# Altium schematic sheet [1]-SOM-G3399.SchDoc: [1]-SOM-G3399
size A3; DocumentNumber: NA; Revision: 2019.12.17; SheetNumber: 1; SheetTotal: 3
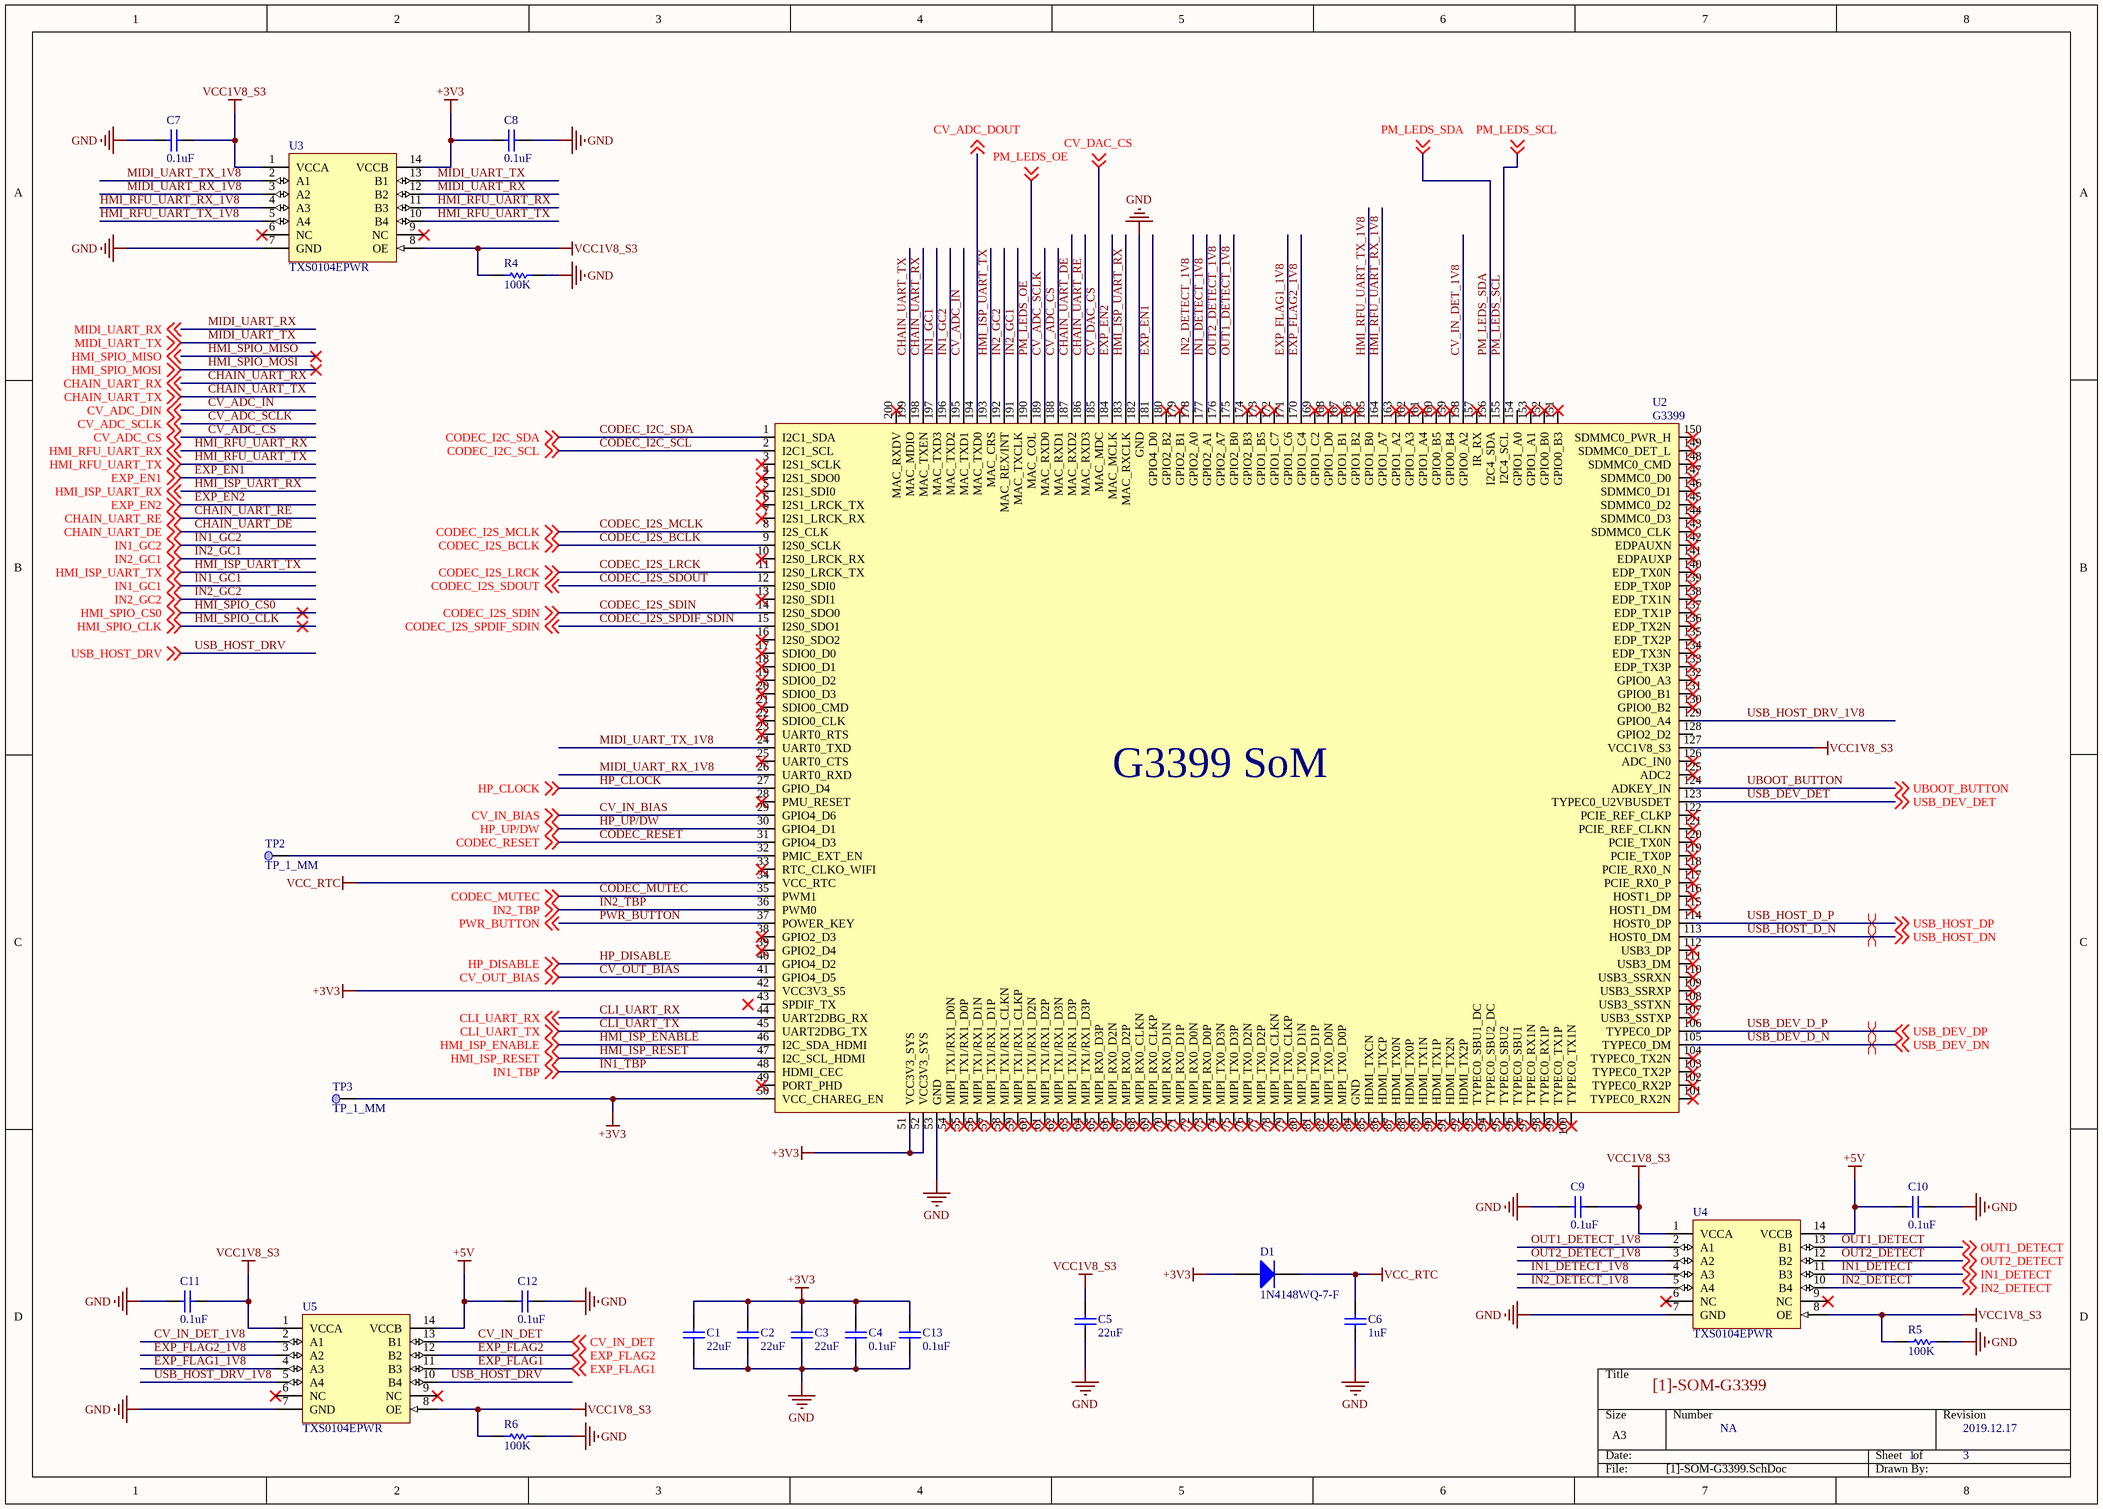
[diagram p0: [1]-SOM-G3399.SchDoc]

## Parts
C1  22uF  [CAPC1608N]
C2  22uF  [CAPC1608N]
C3  22uF  [CAPC1608N]
C4  0.1uF  [CAPC1005N]
C5  22uF  [CAPC1608N]
C6  1uF  [CAPC1005N]
C7  0.1uF  [CAPC1005N]
C8  0.1uF  [CAPC1005N]
C9  0.1uF  [CAPC1005N]
C10  0.1uF  [CAPC1005N]
C11  0.1uF  [CAPC1005N]
C12  0.1uF  [CAPC1005N]
C13  0.1uF  [CAPC1005N]
D1  1N4148WQ-7-F  [SOD123]
R4  100K  [RESC1005N]
R5  100K  [RESC1005N]
R6  100K  [RESC1005N]
TP2  TP_1_MM  [TP_1_MM]  (no BOM)
TP3  TP_1_MM  [TP_1_MM]  (no BOM)
U2  G3399  [G3399-MOD]
U3  TXS0104EPWR  [TSSOP_PW14]
U4  TXS0104EPWR  [TSSOP_PW14]
U5  TXS0104EPWR  [TSSOP_PW14]

## Nets
+3V3: C1.2 C2.2 C3.2 C4.2 C8.2 C13.2 D1.2(A) TP3.1 U2.42(VCC3V3_S5) U2.50(VCC_CHAREG_EN) U2.51(VCC3V3_SYS) U2.52(VCC3V3_SYS) U3.14(VCCB)
+5V: C10.2 C12.2 U4.14(VCCB) U5.14(VCCB)
GND: C1.1 C2.1 C3.1 C4.1 C5.1 C6.1 C7.1 C8.1 C9.1 C10.1 C11.1 C12.1 C13.1 R4.2 R5.2 R6.1 U2.53(GND) U2.182(GND) U3.7(GND) U4.7(GND) U5.7(GND)
VCC1V8_S3: C5.2 C7.2 C9.2 C11.2 R4.1 R5.1 R6.2 U2.127(VCC1V8_S3) U3.1(VCCA) U3.8(OE) U4.1(VCCA) U4.8(OE) U5.1(VCCA) U5.8(OE)
VCC_RTC: C6.2 D1.1(K) U2.34(VCC_RTC)
CHAIN_UART_DE: U2.187(MAC_RXD2) ; off-sheet CHAIN_UART_DE
CHAIN_UART_RE: U2.186(MAC_RXD3) ; off-sheet CHAIN_UART_RE
CHAIN_UART_RX: U2.198(MAC_TXEN) ; off-sheet CHAIN_UART_RX
CHAIN_UART_TX: U2.199(MAC_MDIO) ; off-sheet CHAIN_UART_TX
CLI_UART_RX: U2.44(UART2DBG_RX) ; off-sheet CLI_UART_RX
CLI_UART_TX: U2.45(UART2DBG_TX) ; off-sheet CLI_UART_TX
CODEC_I2C_SCL: U2.2(I2C1_SCL) ; off-sheet CODEC_I2C_SCL
CODEC_I2C_SDA: U2.1(I2C1_SDA) ; off-sheet CODEC_I2C_SDA
CODEC_I2S_BCLK: U2.9(I2S0_SCLK) ; off-sheet CODEC_I2S_BCLK
CODEC_I2S_LRCK: U2.11(I2S0_LRCK_TX) ; off-sheet CODEC_I2S_LRCK
CODEC_I2S_MCLK: U2.8(I2S_CLK) ; off-sheet CODEC_I2S_MCLK
CODEC_I2S_SDIN: U2.14(I2S0_SDO0) ; off-sheet CODEC_I2S_SDIN
CODEC_I2S_SDOUT: U2.12(I2S0_SDI0) ; off-sheet CODEC_I2S_SDOUT
CODEC_I2S_SPDIF_SDIN: U2.15(I2S0_SDO1) ; off-sheet CODEC_I2S_SPDIF_SDIN
CODEC_MUTEC: U2.35(PWM1) ; off-sheet CODEC_MUTEC
CODEC_RESET: U2.31(GPIO4_D3) ; off-sheet CODEC_RESET
CV_ADC_CS: U2.188(MAC_RXD1) ; off-sheet CV_ADC_CS
CV_ADC_DOUT: U2.194(MAC_TXD0) ; off-sheet CV_ADC_DOUT
CV_ADC_IN: U2.195(MAC_TXD1) ; off-sheet CV_ADC_DIN  [also labelled CV_ADC_DIN]
CV_ADC_SCLK: U2.189(MAC_RXD0) ; off-sheet CV_ADC_SCLK
CV_DAC_CS: U2.185(MAC_MDC) ; off-sheet CV_DAC_CS
CV_IN_BIAS: U2.29(GPIO4_D6) ; off-sheet CV_IN_BIAS
CV_IN_DET: U5.13(B1) ; off-sheet CV_IN_DET
CV_IN_DET_1V8: U2.158(GPIO0_A2) U5.2(A1)
CV_OUT_BIAS: U2.41(GPIO4_D5) ; off-sheet CV_OUT_BIAS
EXP_EN1: U2.181(GPIO4_D0) ; off-sheet EXP_EN1
EXP_EN2: U2.184(MAC_MCLK) ; off-sheet EXP_EN2
EXP_FLAG1: U5.11(B3) ; off-sheet EXP_FLAG1
EXP_FLAG1_1V8: U2.171(GPIO1_C6) U5.4(A3)
EXP_FLAG2: U5.12(B2) ; off-sheet EXP_FLAG2
EXP_FLAG2_1V8: U2.170(GPIO1_C4) U5.3(A2)
HMI_ISP_ENABLE: U2.46(I2C_SDA_HDMI) ; off-sheet HMI_ISP_ENABLE
HMI_ISP_RESET: U2.47(I2C_SCL_HDMI) ; off-sheet HMI_ISP_RESET
HMI_ISP_UART_RX: U2.183(MAC_RXCLK) ; off-sheet HMI_ISP_UART_RX
HMI_ISP_UART_TX: U2.193(MAC_CRS) ; off-sheet HMI_ISP_UART_TX
HMI_RFU_UART_RX: U3.11(B3) ; off-sheet HMI_RFU_UART_RX
HMI_RFU_UART_RX_1V8: U2.164(GPIO1_A7) U3.4(A3)
HMI_RFU_UART_TX: U3.10(B4) ; off-sheet HMI_RFU_UART_TX
HMI_RFU_UART_TX_1V8: U2.165(GPIO1_B0) U3.5(A4)
HP_CLOCK: U2.27(GPIO_D4) ; off-sheet HP_CLOCK
HP_DISABLE: U2.40(GPIO4_D2) ; off-sheet HP_DISABLE
HP_UP/DW: U2.30(GPIO4_D1) ; off-sheet HP_UP/DW
IN1_DETECT: U4.11(B3) ; off-sheet IN1_DETECT
IN1_DETECT_1V8: U2.177(GPIO2_A1) U4.4(A3)
IN1_GC1: U2.197(MAC_TXD3) ; off-sheet IN1_GC1
IN1_GC2: U2.196(MAC_TXD2) ; off-sheet IN1_GC2
IN1_TBP: U2.48(HDMI_CEC) ; off-sheet IN1_TBP
IN2_DETECT: U4.10(B4) ; off-sheet IN2_DETECT
IN2_DETECT_1V8: U2.178(GPIO2_A0) U4.5(A4)
IN2_GC1: U2.191(MAC_TXCLK) ; off-sheet IN2_GC1
IN2_GC2: U2.192(MAC_REX/INT) ; off-sheet IN2_GC2
IN2_TBP: U2.36(PWM0) ; off-sheet IN2_TBP
MIDI_UART_RX: U3.12(B2) ; off-sheet MIDI_UART_RX
MIDI_UART_RX_1V8: U2.26(UART0_RXD) U3.3(A2)
MIDI_UART_TX: U3.13(B1) ; off-sheet MIDI_UART_TX
MIDI_UART_TX_1V8: U2.24(UART0_TXD) U3.2(A1)
OUT1_DETECT: U4.13(B1) ; off-sheet OUT1_DETECT
OUT1_DETECT_1V8: U2.175(GPIO2_B0) U4.2(A1)
OUT2_DETECT: U4.12(B2) ; off-sheet OUT2_DETECT
OUT2_DETECT_1V8: U2.176(GPIO2_A7) U4.3(A2)
PM_LEDS_OE: U2.190(MAC_COL) ; off-sheet PM_LEDS_OE
PM_LEDS_SCL: U2.155(I2C4_SCL) ; off-sheet PM_LEDS_SCL
PM_LEDS_SDA: U2.156(I2C4_SDA) ; off-sheet PM_LEDS_SDA
PWR_BUTTON: U2.37(POWER_KEY) ; off-sheet PWR_BUTTON
UBOOT_BUTTON: U2.124(ADKEY_IN) ; off-sheet UBOOT_BUTTON
USB_DEV_D_N: U2.105(TYPEC0_DM) ; off-sheet USB_DEV_DN  [also labelled USB_DEV_DN]
USB_DEV_D_P: U2.106(TYPEC0_DP) ; off-sheet USB_DEV_DP  [also labelled USB_DEV_DP]
USB_DEV_DET: U2.123(TYPEC0_U2VBUSDET) ; off-sheet USB_DEV_DET
USB_HOST_D_N: U2.113(HOST0_DM) ; off-sheet USB_HOST_DN  [also labelled USB_HOST_DN]
USB_HOST_D_P: U2.114(HOST0_DP) ; off-sheet USB_HOST_DP  [also labelled USB_HOST_DP]
USB_HOST_DRV: U5.10(B4) ; off-sheet USB_HOST_DRV
USB_HOST_DRV_1V8: U2.129(GPIO0_A4) U5.5(A4)
NetTP2_1: TP2.1 U2.32(PMIC_EXT_EN)

Not connected (* = marked no-connect by the designer): U2 3(I2S1_SCLK)* 4(I2S1_SDO0)* 5(I2S1_SDI0)* 6(I2S1_LRCK_TX)* 7(I2S1_LRCK_RX)* 10(I2S0_LRCK_RX)* 13(I2S0_SDI1)* 16(I2S0_SDO2)* 17(SDIO0_D0)* 18(SDIO0_D1)* 19(SDIO0_D2)* 20(SDIO0_D3)* 21(SDIO0_CMD)* 22(SDIO0_CLK)* 23(UART0_RTS)* 25(UART0_CTS)* 28(PMU_RESET)* 33(RTC_CLKO_WIFI)* 38(GPIO2_D3)* 39(GPIO2_D4)* 43(SPDIF_TX) 49(PORT_PHD)* 54(MIPI_TX1/RX1_D0N)* 55(MIPI_TX1/RX1_D0P)* 56(MIPI_TX1/RX1_D1N)* 57(MIPI_TX1/RX1_D1P)* 58(MIPI_TX1/RX1_CLKN)* 59(MIPI_TX1/RX1_CLKP)* 60(MIPI_TX1/RX1_D2N)* 61(MIPI_TX1/RX1_D2P)* 62(MIPI_TX1/RX1_D3N)* 63(MIPI_TX1/RX1_D3P)* 64(MIPI_TX1/RX1_D3P)* 65(MIPI_RX0_D3P)* 66(MIPI_RX0_D2N)* 67(MIPI_RX0_D2P)* 68(MIPI_RX0_CLKN)* 69(MIPI_RX0_CLKP)* 70(MIPI_RX0_D1N)* 71(MIPI_RX0_D1P)* 72(MIPI_RX0_D0N)* 73(MIPI_RX0_D0P)* 74(MIPI_TX0_D3N)* 75(MIPI_TX0_D3P)* 76(MIPI_TX0_D2N)* 77(MIPI_TX0_D2P)* 78(MIPI_TX0_CLKN)* 79(MIPI_TX0_CLKP)* 80(MIPI_TX0_D1N)* 81(MIPI_TX0_D1P)* 82(MIPI_TX0_D0N)* 83(MIPI_TX0_D0P)* 84(GND)* 85(HDMI_TXCN)* 86(HDMI_TXCP)* 87(HDMI_TX0N)* 88(HDMI_TX0P)* 89(HDMI_TX1N)* 90(HDMI_TX1P)* 91(HDMI_TX2N)* 92(HDMI_TX2P)* 93(TYPEC0_SBU1_DC)* 94(TYPEC0_SBU2_DC)* 95(TYPEC0_SBU2)* 96(TYPEC0_SBU1)* 97(TYPEC0_RX1N)* 98(TYPEC0_RX1P)* 99(TYPEC0_TX1P)* 100(TYPEC0_TX1N)* 101(TYPEC0_RX2N)* 102(TYPEC0_RX2P)* 103(TYPEC0_TX2P)* 104(TYPEC0_TX2N)* 107(USB3_SSTXP)* 108(USB3_SSTXN)* 109(USB3_SSRXP)* 110(USB3_SSRXN)* 111(USB3_DM)* 112(USB3_DP)* 115(HOST1_DM)* 116(HOST1_DP)* 117(PCIE_RX0_P)* 118(PCIE_RX0_N)* 119(PCIE_TX0P)* 120(PCIE_TX0N)* 121(PCIE_REF_CLKN)* 122(PCIE_REF_CLKP)* 125(ADC2)* 126(ADC_IN0)* 128(GPIO2_D2) 130(GPIO0_B2)* 131(GPIO0_B1)* 132(GPIO0_A3)* 133(EDP_TX3P)* 134(EDP_TX3N)* 135(EDP_TX2P)* 136(EDP_TX2N)* 137(EDP_TX1P)* 138(EDP_TX1N)* 139(EDP_TX0P)* 140(EDP_TX0N)* 141(EDPAUXP)* 142(EDPAUXN)* 143(SDMMC0_CLK)* 144(SDMMC0_D3)* 145(SDMMC0_D2)* 146(SDMMC0_D1)* 147(SDMMC0_D0)* 148(SDMMC0_CMD)* 149(SDMMC0_DET_L)* 150(SDMMC0_PWR_H)* 151(GPIO0_B3)* 152(GPIO0_B0)* 153(GPIO1_A1)* 154(GPIO1_A0) 157(IR_RX)* 159(GPIO0_B4)* 160(GPIO0_B5)* 161(GPIO1_A4)* 162(GPIO1_A3)* 163(GPIO1_A2)* 166(GPIO1_B2)* 167(GPIO1_B1)* 168(GPIO1_D0)* 169(GPIO1_C2)* 172(GPIO1_C7)* 173(GPIO1_B5)* 174(GPIO2_B3)* 179(GPIO2_B1)* 180(GPIO2_B2)* 200(MAC_RXDV)*; U3 6(NC)* 9(NC)*; U4 6(NC)* 9(NC)*; U5 6(NC)* 9(NC)*

## Layout directives
differential pair: USB_DEV_D_N, USB_DEV_D_P, USB_HOST_D_N, USB_HOST_D_P

## Notes on the sheet
- (in symbol G3399) G3399 SoM

## Library data of the parts
C1-C3 C5 = GRM188R60J226MEA0D: CAP CER 22UF 6.3V X5R 0603; Manufacturer 1: Murata; Tolerance: 20%; Supplier 1: Digi-Key; Manufacturer Part Number 1: GRM188R60J226MEA0D; Stock 1: 40000; Pricing 1: 1=0.26, 10=0.177, 100=0.1001, 500=0.07066, 1000=0.06182 (USD); Mount: Surface Mount; Case/Package: 0603; Weight: 0.000222oz; Case Code (Metric): 1608; Case Code (Imperial): 0603; Min Operating Temperature: -55°C; Max Operating Temperature: 85°C; Capacitance: 22uF; Packaging: Tape and Reel; Package Quantity: 4000; Voltage Rating: 6.3V; Dielectric: X5R; Termination: SMD/SMT; Voltage Rating (DC): 6.3V; Length: 1.6mm; Height: 0.8mm; Width: 0.8mm; Thickness: 0.039inch; Depth: 0.8mm; REACH SVHC: No SVHC; Lead Free: Lead Free; ComponentLink1URL: https://www.murata.com/~/media/webrenewal/support/library/catalog/products/capacitor/mlcc/c02e.ashx?la=en-us; ComponentLink1Description: https://www.murata.com/~/media/webrenewal/support/library/catalog/products/capacitor/mlcc/c02e.ashx?la=en-us; Supplier Part Number 1: 490-7611-1-ND
C4 C7-C13 = GRM155R71H104KE14D: CAP CER 0.1UF 50V X7R 0402; Manufacturer 1: Murata; Description 1: Cap Ceramic 0.1uF 50V X7R 10% SMD 0402 125C Paper T/R; Voltage Rating DC: 50 VDC; Tolerance: 10 %; Brand: Murata Electronics; Capacitance - nF: 100 nF; Capacitance - pF: 100000 pF; Class: Class 2; Type: General Purpose Ceramic Capacitors; Unit Weight: 0.000212 oz; Supplier 1: Digi-Key; Manufacturer Part Number 1: GRM155R71H104KE14D; Stock 1: 0; Pricing 1: 1=0.1, 10=0.022, 100=0.0099, 500=0.0071, 1000=0.0056, 2500=0.0051, 5000=0.0047 (USD); Product Category: Multilayer Ceramic Capacitors MLCC - SMD/SMT; RoHS: True; Capacitance: 0.1 uF; Dielectric: X7R; Case Code - in: 0402; Case Code - mm: 1005; Height: 0.5 mm; Maximum Operating Temperature: + 125 C; Minimum Operating Temperature: - 55 C; Product: General Type MLCCs; Series: GRM; Packaging: Reel; Length: 1 mm; Package / Case: 0402 (1005 metric); Factory Pack Quantity: 10000; Termination Style: SMD/SMT; Width: 0.5 mm; ComponentLink1URL: http://components.arrow.com/part/dataview/0323_07030614; ComponentLink1Description: http://components.arrow.com/part/dataview/0323_07030614; ComponentLink2URL: http://psearch.en.murata.com/capacitor/product/GRM155R71H104KE14%23.pdf; ComponentLink2Description: http://psearch.en.murata.com/capacitor/product/GRM155R71H104KE14%23.pdf; ComponentLink3URL: http://www.mouser.com/ds/2/281/c02e-2905.pdf; ComponentLink3Description: http://www.mouser.com/ds/2/281/c02e-2905.pdf; ComponentLink4URL: http://search.murata.co.jp/Ceramy/image/img/A01X/partnumbering_e_01.pdf; ComponentLink4Description: http://search.murata.co.jp/Ceramy/image/img/A01X/partnumbering_e_01.pdf; ComponentLink5URL: http://www.farnell.com/datasheets/2079156.pdf; ComponentLink5Description: http://www.farnell.com/datasheets/2079156.pdf; Supplier Part Number 1: 490-10700-1-ND
C6 = C0402C105K9PACTU: CAP CER 1UF 6.3V X5R 0402; Manufacturer 1: KEMET; Product Training Modules: Capacitor Basics- Typical Uses for Capacitors; Capacitance: 1µF; Tolerance: ±10%; Online Catalog: X5R Dielectric (Commercial Grade); Kits: 399-5085-ND  - KIT CER HI CAPACITANCE CHIP CAPS; Other Names: 399-4873-1; Supplier 1: Digi-Key; Manufacturer Part Number 1: C0402C105K9PACTU; Description 1: CAP CER 1UF 6.3V X5R 0402; Stock 1: 0; Pricing 1: 1=0.1, 10=0.022, 100=0.0097, 500=0.007, 1000=0.0055, 2500=0.005, 5000=0.0046 (USD); Standard Package: 1; Category: Capacitors; Family: Ceramic Capacitors; Series: C; Packaging: Cut Tape (CT); Voltage - Rated: 6.3V; Temperature Coefficient: X5R; Mounting Type: Surface Mount, MLCC; Operating Temperature: -55°C ~ 85°C; Applications: General Purpose; Ratings: -; Package / Case: 0402 (1005 Metric); Size / Dimension: 0.039" L x 0.020" W (1.00mm x 0.50mm); Height - Seated (Max): -; Thickness (Max): 0.022" (0.55mm); Lead Spacing: -; Features: -; Lead Style: -; ComponentLink1URL: https://datasheet.ciiva.com/144/docfinderpartnumber-c0402c105k9pactu-144529.pdf; ComponentLink1Description: https://datasheet.ciiva.com/144/docfinderpartnumber-c0402c105k9pactu-144529.pdf; ComponentLink2URL: https://datasheet.ciiva.com/28645/1789732-28645392.pdf; ComponentLink2Description: https://datasheet.ciiva.com/28645/1789732-28645392.pdf; ComponentLink3URL: https://datasheet.ciiva.com/7747/40889-7747623.pdf; ComponentLink3Description: https://datasheet.ciiva.com/7747/40889-7747623.pdf; ComponentLink4URL: https://datasheet.ciiva.com/18192/getdatasheetpartid-127800-18192427.pdf; ComponentLink4Description: https://datasheet.ciiva.com/18192/getdatasheetpartid-127800-18192427.pdf; ComponentLink5URL: https://datasheet.ciiva.com/7747/kem-c1006-x5r-smd-7747445.pdf; ComponentLink5Description: https://datasheet.ciiva.com/7747/kem-c1006-x5r-smd-7747445.pdf; ComponentLink6URL: https://datasheet.ciiva.com/5414/kem-c1006-x5r-smd-5414919.pdf; ComponentLink6Description: https://datasheet.ciiva.com/5414/kem-c1006-x5r-smd-5414919.pdf; Supplier Part Number 1: 399-4873-1-ND
D1 = 1N4148WQ-7-F: DIODE GEN PURP 100V 300MA SOD123; Manufacturer 1: Diodes Zetex; Max Surge Current: 2A; Forward Voltage: 1.25V; Element Configuration: Single; Recovery Time: 4ns; Peak Reverse Current: 50uA; Max Power Dissipation: 400mW; Supplier 1: Digi-Key; Manufacturer Part Number 1: 1N4148WQ-7-F; Stock 1: 65303; Pricing 1: 1=0.22, 10=0.196, 100=0.107, 500=0.06582, 1000=0.04488 (USD); Mount: Surface Mount; Case/Package: SOD-123-2; Number of Pins: 2; Weight: 0.000353oz; Contact Plating: Matte,Tin; Min Operating Temperature: -65°C; Max Operating Temperature: 150°C; Packaging: Tape and Reel; Peak Non-Repetitive Surge Current: 2A; Forward Current: 300mA; Package Quantity: 3000; Reverse Recovery Time: 4ns; Max Repetitive Reverse Voltage (Vrrm): 100V; Lead Free: Lead Free; Supplier Part Number 1: 1N4148WQ-7-FDICT-ND
R4-R6 = RC0402FR-07100KL: RES SMD 100K OHM 1% 1/16W 0402; Manufacturer 1: Yageo; Resistance: 100 kOhms; Power Rating: 62.5 mW (1/16 W); Voltage Rating: 50 V; Temperature Coefficient: 100 PPM / C; Supplier 1: Digi-Key; Manufacturer Part Number 1: RC0402FR-07100KL; Description 1: RES SMD 100K OHM 1% 1/16W 0402; Stock 1: 10691398; Pricing 1: 1=0.1, 10=0.014, 100=0.0056, 1000=0.0025, 2500=0.0022, 5000=0.0018 (USD); Termination Style: SMD/SMT; Product: Thick Film Resistors General Purpose; Tolerance: 1 %; Case Code - in: 0402; Case Code - mm: 1005; Series: RC; Operating Temperature Range: - 55 C to + 155 C; Packaging: Reel; ComponentLink1URL: https://datasheet.ciiva.com/11819/0900766b80c66297-11819452.pdf; ComponentLink1Description: https://datasheet.ciiva.com/11819/0900766b80c66297-11819452.pdf; ComponentLink2URL: https://datasheet.ciiva.com/16740/pyu-rc0402-51-rohs-l-6-r-16740567.pdf; ComponentLink2Description: https://datasheet.ciiva.com/16740/pyu-rc0402-51-rohs-l-6-r-16740567.pdf; ComponentLink3URL: https://datasheet.ciiva.com/12667/pyu-rc0402-51-rohs-l-6-r-12667930.pdf; ComponentLink3Description: https://datasheet.ciiva.com/12667/pyu-rc0402-51-rohs-l-6-r-12667930.pdf; ComponentLink4URL: https://datasheet.ciiva.com/2453/pyu-r-int-thick-7-2453361.pdf; ComponentLink4Description: https://datasheet.ciiva.com/2453/pyu-r-int-thick-7-2453361.pdf; ComponentLink5URL: https://datasheet.ciiva.com/15189/getdatasheetpartid-323696-15189334.pdf; ComponentLink5Description: https://datasheet.ciiva.com/15189/getdatasheetpartid-323696-15189334.pdf; ComponentLink6URL: https://datasheet.ciiva.com/2453/pyu-r-int-thick-7-2453362.pdf; ComponentLink6Description: https://datasheet.ciiva.com/2453/pyu-r-int-thick-7-2453362.pdf; ComponentLink7URL: https://datasheet.ciiva.com/2453/pyu-r-int-thick-7-2453363.pdf; ComponentLink7Description: https://datasheet.ciiva.com/2453/pyu-r-int-thick-7-2453363.pdf; ComponentLink8URL: https://datasheet.ciiva.com/22747/1018594-22747509.pdf; ComponentLink8Description: https://datasheet.ciiva.com/22747/1018594-22747509.pdf; Supplier Part Number 1: 311-100KLRCT-ND
U2 = G3399: ROCKCHIP R3399 SoM
U3-U5 = IC_TXS0104EPWRG4: IC TRNSLTR BIDIRECTIONAL 14TSSOP; Manufacturer 1: Texas Instruments; Max Supply Voltage: 5.5V; Min Supply Voltage: 2.3V; Propagation Delay: 260ns; Data Rate: 24Mbps; Number of Channels: 4; Logic Function: Translator; High Level Output Current: -20uA; Low Level Output Current: 1mA; Quiescent Current: 14.4uA; Output Type: Voltage; Supplier 1: Digi-Key; Stock 1: 1124; Pricing 1: 1=1.35000, 10=1.20300, 100=0.93810, 500=0.77498, 1000=0.61182 (USD); RoHS: Yes; Mount: Surface Mount; Case/Package: TSSOP; Number of Pins: 14; Weight: 0.002018oz; Min Operating Temperature: -40°C; Max Operating Temperature: 85°C; Packaging: Tape and Reel; Package Quantity: 2000; Number of Bits: 4; Turn-On Delay Time: 260ns; Length: 5mm; Height: 1.15mm; Width: 4.4mm; Radiation Hardening: No; Lead Free: Lead Free; ComponentLink1URL: https://datasheet.ciiva.com/4834/sces651d-126957-4834816.pdf?src-supplier=Mouser; ComponentLink1Description: https://datasheet.ciiva.com/4834/sces651d-126957-4834816.pdf?src-supplier=Mouser; ComponentLink2URL: https://datasheet.ciiva.com/15096/getdatasheetpartid-394723-15096293.pdf?src-supplier=Verical; ComponentLink2Description: https://datasheet.ciiva.com/15096/getdatasheetpartid-394723-15096293.pdf?src-supplier=Verical; ComponentLink3URL: https://datasheet.ciiva.com/26039/txs0104e-26039590.pdf?src-supplier=Avnet+Europe; ComponentLink3Description: https://datasheet.ciiva.com/26039/txs0104e-26039590.pdf?src-supplier=Avnet+Europe; ComponentLink4URL: https://datasheet.ciiva.com/14287/txs0104e-14287679.pdf?src-supplier=Avnet; ComponentLink4Description: https://datasheet.ciiva.com/14287/txs0104e-14287679.pdf?src-supplier=Avnet; ComponentLink5URL: https://datasheet.ciiva.com/1900/txs0104e-1900897.pdf?src-supplier=Digi-Key; ComponentLink5Description: https://datasheet.ciiva.com/1900/txs0104e-1900897.pdf?src-supplier=Digi-Key; Supplier Part Number 1: 296-52841-1-ND; Manufacturer Part Number 1: TXS0104EPWRG4